# Altium schematic sheet MainSch.SchDoc
size A4; SheetNumber: 2; SheetTotal: 2
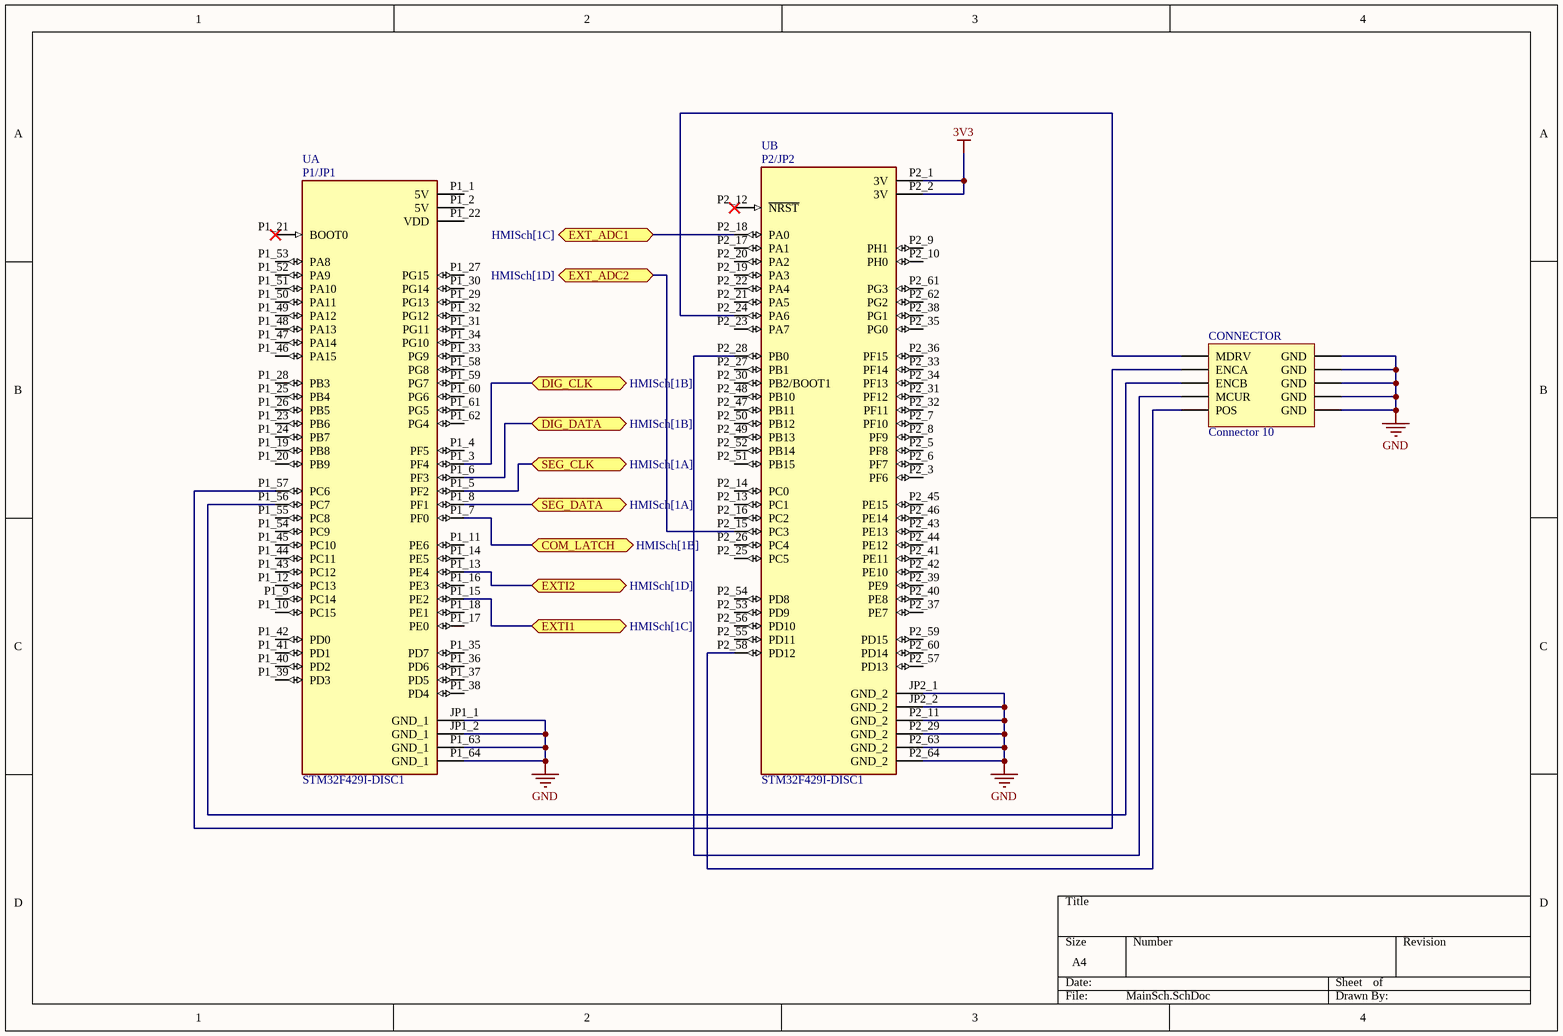
[diagram p0: MainSch.SchDoc]

## Parts
CONNECTOR  Connector 10  [CONNECTOR-10P]
U  STM32F429I-DISC1  [MODULE_STM32F429I-DISC1]  (parts A,B of 2)

## Ports
COM_LATCH (bidir, see HMISch[1B]), DIG_CLK (bidir, see HMISch[1B]), DIG_DATA (bidir, see HMISch[1B]), EXT_ADC1 (bidir, see HMISch[1C]), EXT_ADC2 (bidir, see HMISch[1D]), EXTI1 (bidir, see HMISch[1C]), EXTI2 (bidir, see HMISch[1D]), SEG_CLK (bidir, see HMISch[1A]), SEG_DATA (bidir, see HMISch[1A])

## Nets
3V3: U.P2_1(3V) U.P2_2(3V)
GND: CONNECTOR.2(GND) CONNECTOR.4(GND) CONNECTOR.6(GND) CONNECTOR.8(GND) CONNECTOR.10(GND) U.JP1_1(GND_1) U.JP1_2(GND_1) U.JP2_1(GND_2) U.JP2_2(GND_2) U.P1_63(GND_1) U.P1_64(GND_1) U.P2_11(GND_2) U.P2_29(GND_2) U.P2_63(GND_2) U.P2_64(GND_2)
COM_LATCH: U.P1_7(PF0) ; port COM_LATCH
DIG_CLK: U.P1_3(PF4) ; port DIG_CLK
DIG_DATA: U.P1_6(PF3) ; port DIG_DATA
EXT_ADC1: U.P2_18(PA0) ; port EXT_ADC1
EXT_ADC2: U.P2_15(PC3) ; port EXT_ADC2
EXTI1: U.P1_15(PE2) ; port EXTI1
EXTI2: U.P1_13(PE4) ; port EXTI2
SEG_CLK: U.P1_5(PF2) ; port SEG_CLK
SEG_DATA: U.P1_8(PF1) ; port SEG_DATA
NetCONNECTOR_1: CONNECTOR.1(MDRV) U.P2_24(PA6)
NetCONNECTOR_3: CONNECTOR.3(ENCA) U.P1_57(PC6)
NetCONNECTOR_5: CONNECTOR.5(ENCB) U.P1_56(PC7)
NetCONNECTOR_7: CONNECTOR.7(MCUR) U.P2_28(PB0)
NetCONNECTOR_9: CONNECTOR.9(POS) U.P2_58(PD12)

Not connected (* = marked no-connect by the designer): U P1_1(5V) P1_2(5V) P1_4(PF5) P1_9(PC14) P1_10(PC15) P1_11(PE6) P1_12(PC13) P1_14(PE5) P1_16(PE3) P1_17(PE0) P1_18(PE1) P1_19(PB8) P1_20(PB9) P1_21(BOOT0)* P1_22(VDD) P1_23(PB6) P1_24(PB7) P1_25(PB4) P1_26(PB5) P1_27(PG15) P1_28(PB3) P1_29(PG13) P1_30(PG14) P1_31(PG11) P1_32(PG12) P1_33(PG9) P1_34(PG10) P1_35(PD7) P1_36(PD6) P1_37(PD5) P1_38(PD4) P1_39(PD3) P1_40(PD2) P1_41(PD1) P1_42(PD0) P1_43(PC12) P1_44(PC11) P1_45(PC10) P1_46(PA15) P1_47(PA14) P1_48(PA13) P1_49(PA12) P1_50(PA11) P1_51(PA10) P1_52(PA9) P1_53(PA8) P1_54(PC9) P1_55(PC8) P1_58(PG8) P1_59(PG7) P1_60(PG6) P1_61(PG5) P1_62(PG4) P2_3(PF6) P2_5(PF8) P2_6(PF7) P2_7(PF10) P2_8(PF9) P2_9(PH1) P2_10(PH0) P2_12(~{NRST})* P2_13(PC1) P2_14(PC0) P2_16(PC2) P2_17(PA1) P2_19(PA3) P2_20(PA2) P2_21(PA5) P2_22(PA4) P2_23(PA7) P2_25(PC5) P2_26(PC4) P2_27(PB1) P2_30(PB2/BOOT1) P2_31(PF12) P2_32(PF11) P2_33(PF14) P2_34(PF13) P2_35(PG0) P2_36(PF15) P2_37(PE7) P2_38(PG1) P2_39(PE9) P2_40(PE8) P2_41(PE11) P2_42(PE10) P2_43(PE13) P2_44(PE12) P2_45(PE15) P2_46(PE14) P2_47(PB11) P2_48(PB10) P2_49(PB13) P2_50(PB12) P2_51(PB15) P2_52(PB14) P2_53(PD9) P2_54(PD8) P2_55(PD11) P2_56(PD10) P2_57(PD13) P2_59(PD15) P2_60(PD14) P2_61(PG3) P2_62(PG2)

## Notes on the sheet
- (in symbol STM32F429I-DISC1, part A) P1/JP1
- (in symbol STM32F429I-DISC1, part B) P2/JP2

## Library data of the parts
CONNECTOR = Connector 10 spec: Special 10 pin ribbon connector; Reference: *; Supplier: *; Name: *
U = STM32F429I-DISC1: STM32F429 Discovery STM32F4 ARMÂ® CortexÂ®-M4 MCU 32-Bit Embedded Evaluation Board; MF: STMicroelectronics; SnapEDA_Link: https://www.snapeda.com/parts/STM32F429I-DISC1/STMicroelectronics/view-part/504905/?ref=snap; MP: STM32F429I-DISC1; Price: None; Value: *; Availability: Unavailable; Package: SOIC-14 STMicroelectronics